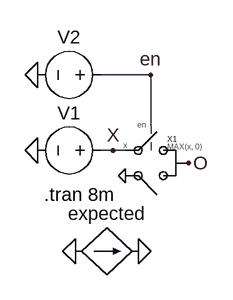
[diagram p0: schematic test-amux-posonly-en.asc]
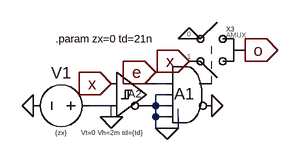
[diagram p1: sub-circuit amux-posonly-en.asc]
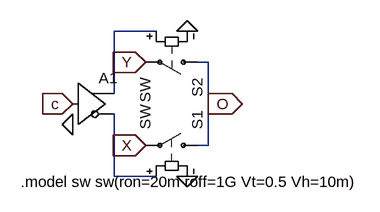
[diagram p2: sub-circuit amux-2to1.asc]
test-amux-posonly-en.asc, the LTspice schematic file:
Version 4
SHEET 1 880 680
WIRE 0 48 -64 48
WIRE 0 112 0 48
WIRE -48 144 -64 144
WIRE -32 144 -48 144
FLAG -144 144 0
FLAG 48 160 O
FLAG -48 144 X
FLAG -96 272 0
FLAG -16 272 0
FLAG -144 48 0
FLAG 0 48 en
SYMBOL voltage -48 144 R90
WINDOW 0 -32 56 VBottom 2
WINDOW 3 32 56 Invisible 2
WINDOW 123 0 0 Left 0
WINDOW 39 0 0 Left 0
SYMATTR InstName V1
SYMATTR Value SINE(0 1 1k)
SYMBOL bi -96 272 R270
WINDOW 0 32 40 VTop 2
WINDOW 3 -32 40 Invisible 2
SYMATTR InstName expected
SYMATTR Value I=IF(V(en),MAX(V(x),0),0)
SYMATTR Value2 Rpar=1
SYMBOL amux-posonly-en 0 176 R0
SYMATTR InstName X1
SYMBOL voltage -48 48 R90
WINDOW 0 -32 56 VBottom 2
WINDOW 3 32 56 Invisible 2
WINDOW 123 0 0 Left 0
WINDOW 39 0 0 Left 0
SYMATTR InstName V2
SYMATTR Value PULSE(0 1 1m 1n 1n 1m 2m)
TEXT -136 200 Left 2 !.tran 8m

amux-posonly-en.asc, the sub-circuit schematic file:
Version 4
SHEET 1 880 680
WIRE 208 144 192 144
WIRE 208 160 192 160
WIRE 208 176 192 176
WIRE 128 192 96 192
WIRE 192 192 192 176
WIRE 208 192 192 192
WIRE 192 208 192 192
WIRE 208 208 192 208
WIRE 192 224 192 208
WIRE 208 224 192 224
WIRE 224 224 224 208
WIRE 224 224 208 224
FLAG 272 192 0
FLAG 208 224 0
FLAG 16 192 0
FLAG 128 160 x
IOPIN 128 160 In
FLAG 192 144 e
IOPIN 192 144 In
FLAG 240 96 0
FLAG 240 128 x
IOPIN 240 128 In
FLAG 320 112 o
IOPIN 320 112 Out
FLAG 128 208 0
SYMBOL Digital\\and 240 112 R0
WINDOW 0 -22 63 Left 2
SYMATTR InstName A1
SYMBOL amux-2to1 272 128 R0
SYMATTR InstName X3
SYMBOL Digital\\diffschmitt 128 112 R0
WINDOW 0 24 63 Left 1
WINDOW 3 -43 119 Left 0
SYMATTR InstName A2
SYMATTR Value Vt=0 Vh=2m td={td}
SYMBOL voltage 112 192 R90
WINDOW 0 -32 56 VBottom 2
WINDOW 3 32 56 VTop 0
SYMATTR InstName V1
SYMATTR Value {zx}
TEXT 48 96 Left 1 !.param zx=0 td=21n

amux-2to1.asc, the sub-circuit schematic file:
Version 4
SHEET 1 880 680
WIRE 64 -160 0 -160
WIRE 144 -112 128 -112
WIRE 0 -64 0 -160
WIRE 144 -48 144 -112
WIRE 144 16 144 -48
WIRE 144 16 128 16
WIRE 0 64 0 -32
WIRE 64 64 0 64
FLAG 112 64 0
FLAG -64 -48 c
IOPIN -64 -48 In
FLAG 112 -160 0
FLAG 48 16 X
IOPIN 48 16 In
FLAG 48 -112 Y
IOPIN 48 -112 In
FLAG 144 -48 O
IOPIN 144 -48 Out
FLAG -64 -16 0
SYMBOL sw 144 16 M270
SYMATTR InstName S1
SYMBOL sw 144 -112 R90
SYMATTR InstName S2
SYMBOL Digital\\buf -64 -112 R0
SYMATTR InstName A1
TEXT -144 72 Left 0 !.model sw sw(ron=20m roff=1G Vt=0.5 Vh=10m)

The netlist it stands for:
* test-amux-posonly-en.asc
V1 X 0 SINE(0 1 1k)
B§expected 0 0 I=IF(V(en),MAX(V(x),0),0) Rpar=1
XX1 O X en amux-posonly-en
V2 en 0 PULSE(0 1 1m 1n 1n 1m 2m)

* block symbol definitions
.subckt amux-posonly-en o x e
A1 e N001 0 0 0 0 P001 0 AND
XX3 P001 o 0 x amux-2to1
A2 x N002 0 0 0 0 N001 0 SCHMITT Vt=0 Vh=2m td={td}
V1 N002 0 {zx}
.param zx=0 td=21n
.ends amux-posonly-en

.subckt amux-2to1 c O X Y
S1 O X N002 0 SW
S2 O Y N001 0 SW
A1 c 0 0 0 0 N002 N001 0 BUF
.model sw sw(ron=20m roff=1G Vt=0.5 Vh=10m)
.ends amux-2to1

.tran 8m
.backanno
.end